# Altium schematic sheet ESP-USB.SchDoc
size C; SheetNumber: 0; SheetTotal: 0
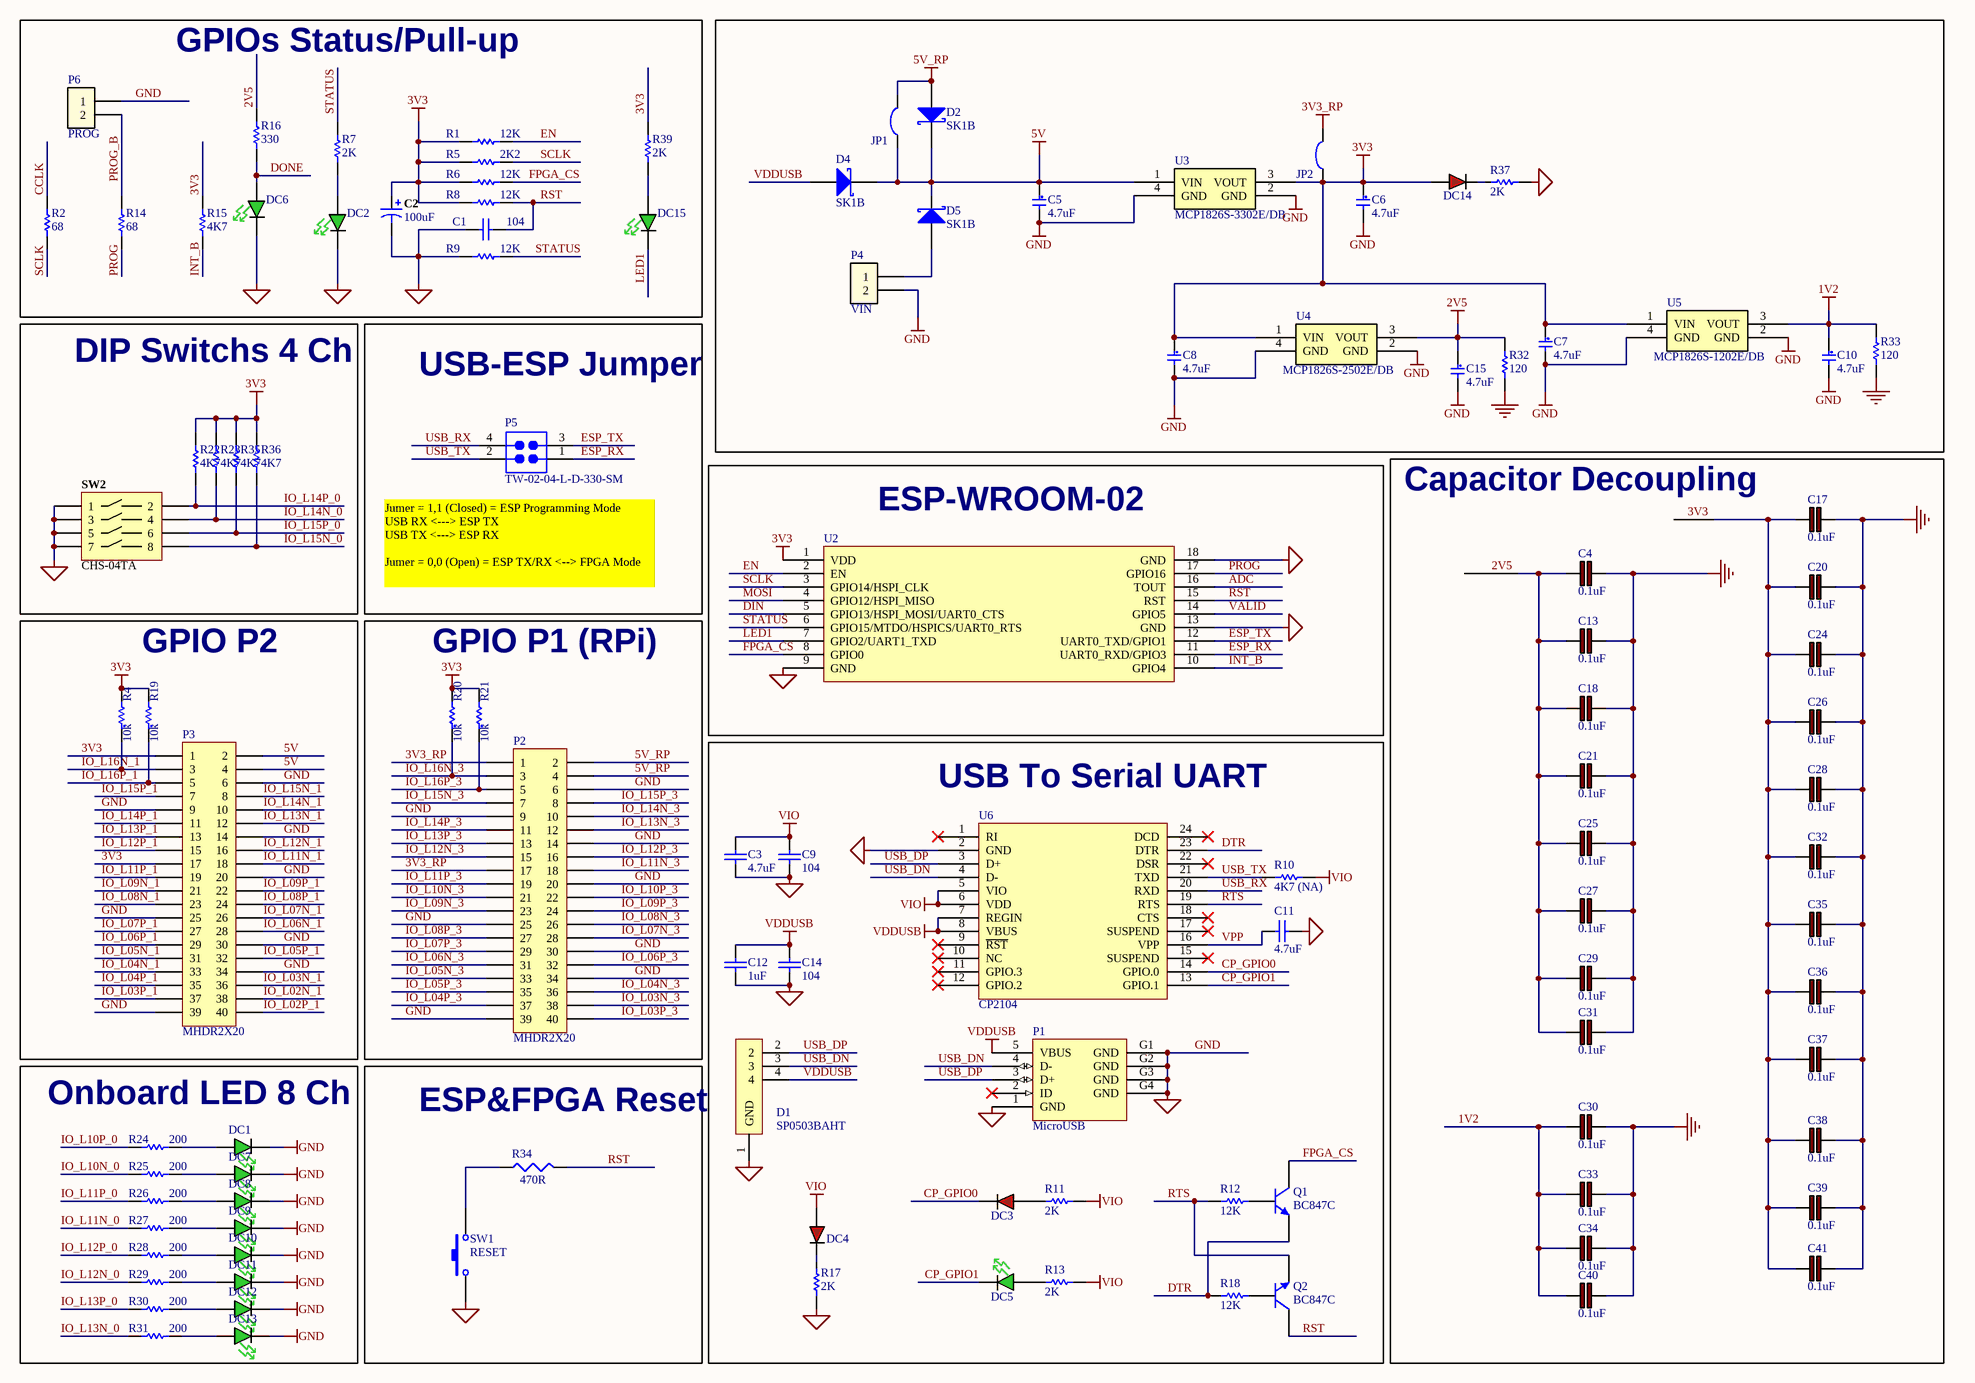
[diagram p0: ESP-USB.SchDoc]

## Parts
C1  104  [C0603 - Marked]
C2  Capacitance: 100uF  [AVX-CAPC3528_V]  (hidden comment: 100 uF Tantalum,)
C3  4.7uF  [C0603 - Marked]
C4  0.1uF  [C0603 - Marked]
C5  4.7uF  [C0603 - Marked]
C6  4.7uF  [C0603 - Marked]
C7  4.7uF  [C0603 - Marked]
C8  4.7uF  [C0603 - Marked]
C9  104  [C0603 - Marked]
C10  4.7uF  [C0603 - Marked]
C11  4.7uF  [C0603 - Marked]
C12  1uF  [C0603 - Marked]
C13  0.1uF  [C0603 - Marked]
C14  104  [C0603 - Marked]
C15  4.7uF  [C0603 - Marked]
C17  0.1uF  [C0603 - Marked]
C18  0.1uF  [C0603 - Marked]
C20  0.1uF  [C0603 - Marked]
C21  0.1uF  [C0603 - Marked]
C24  0.1uF  [C0603 - Marked]
C25  0.1uF  [C0603 - Marked]
C26  0.1uF  [C0603 - Marked]
C27  0.1uF  [C0603 - Marked]
C28  0.1uF  [C0603 - Marked]
C29  0.1uF  [C0603 - Marked]
C30  0.1uF  [C0603 - Marked]
C31  0.1uF  [C0603 - Marked]
C32  0.1uF  [C0603 - Marked]
C33  0.1uF  [C0603 - Marked]
C34  0.1uF  [C0603 - Marked]
C35  0.1uF  [C0603 - Marked]
C36  0.1uF  [C0603 - Marked]
C37  0.1uF  [C0603 - Marked]
C38  0.1uF  [C0603 - Marked]
C39  0.1uF  [C0603 - Marked]
C40  0.1uF  [C0603 - Marked]
C41  0.1uF  [C0603 - Marked]
D1  SP0503BAHT  [SOT143-4]
D2  SK1B  [EDIS_SMA]
D4  SK1B  [EDIS_SMA]
D5  SK1B  [EDIS_SMA]
DC1  (no value)  [LED_0603 - GREEN]
DC2  (no value)  [LED_0603 - GREEN]
DC3  598-8010-107F  [LED_0603 - RED]  (value not drawn)
DC4  598-8010-107F  [LED_0603 - RED]  (value not drawn)
DC5  (no value)  [LED_0603 - GREEN]
DC6  (no value)  [LED_0603 - GREEN]
DC7  (no value)  [LED_0603 - GREEN]
DC8  (no value)  [LED_0603 - GREEN]
DC9  (no value)  [LED_0603 - GREEN]
DC10  (no value)  [LED_0603 - GREEN]
DC11  (no value)  [LED_0603 - GREEN]
DC12  (no value)  [LED_0603 - GREEN]
DC13  (no value)  [LED_0603 - GREEN]
DC14  598-8010-107F  [LED_0603 - RED]  (value not drawn)
DC15  (no value)  [LED_0603 - GREEN]
JP1  Solder Jumper  [SOLDER_JUMPER]  (value not drawn)  (no BOM)
JP2  Solder Jumper  [SOLDER_JUMPER]  (value not drawn)  (no BOM)
P1  MicroUSB  [MICRO-USB-CON]
P2  MHDR2X20  [Raspberry Con]
P3  MHDR2X20  [Raspberry Con]
P4  VIN  [HEADER_2_40_100 THRU SIP]  (no BOM)
P5  TW-02-04-L-D-330-SM  [SMTC-TW-02-04-X-D-330-SM]
P6  PROG  [HEADER_2_40_100 THRU SIP]  (no BOM)
Q1  BC847C  [SOT-23]
Q2  BC847C  [SOT-23]
R1  12K  [R0603]
R2  68  [R0603]
R4  10k  [R0603]
R5  2K2  [R0603]
R6  12K  [R0603]
R7  2K  [R0603]
R8  12K  [R0603]
R9  12K  [R0603]
R10  4K7 (NA)  [R0603]
R11  2K  [R0603]
R12  12K  [R0603]
R13  2K  [R0603]
R14  68  [R0603]
R15  4K7  [R0603]
R16  330  [R0603]
R17  2K  [R0603]
R18  12K  [R0603]
R19  10k  [R0603]
R20  10k  [R0603]
R21  10k  [R0603]
R22  4K7  [R0603]
R23  4K7  [R0603]
R24  200  [R0603]
R25  200  [R0603]
R26  200  [R0603]
R27  200  [R0603]
R28  200  [R0603]
R29  200  [R0603]
R30  200  [R0603]
R31  200  [R0603]
R32  120  [R0603]
R33  120  [R0603]
R34  value 470R  [J1-0603]  (hidden comment: 470)
R35  4K7  [R0603]
R36  4K7  [R0603]
R37  2K  [R0603]
R39  2K  [R0603]
SW1  RESET  [SW_MINI]
SW2  CHS-04TA  [EHS104L]
U2  ESP8266_WROOM_02  [ESP WROOM02-Fit Size]  (value not drawn)
U3  MCP1826S-3302E/DB  [SOT223]
U4  MCP1826S-2502E/DB  [SOT223]
U5  MCP1826S-1202E/DB  [SOT223]
U6  CP2104  [QFN24 - duplicate]

## Blocks framed on the sheet
GPIOs Status/Pull-up: C1 C2 DC2 DC6 DC15 P6 R1 R2 R5-R9 R14-R16 R39
DIP Switchs 4 Ch: R22 R23 R35 R36 SW2
USB-ESP Jumper: P5
ESP-WROOM-02: U2
Capacitor Decoupling: C4 C13 C17 C18 C20 C21 C24-C41
GPIO P2: P3 R4 R19
GPIO P1 (RPi): P2 R20 R21
USB To Serial UART: C3 C9 C11 C12 C14 D1 DC3-DC5 P1 Q1 Q2 R10-R13 R17 R18 U6
Onboard LED 8 Ch: DC1 DC7-DC13 R24-R31
ESP&FPGA Reset: R34 SW1

## Nets
1V2: C10.1 C30.1 C33.1 C34.1 C40.1 R33.1 U5.3(VOUT)
2V5: C4.1 C13.1 C15.1 C18.1 C21.1 C25.1 C27.1 C29.1 C31.1 R16.1 R32.1 U4.3(VOUT)
3V3: C2.1 C6.1 C7.1 C8.1 C17.1 C20.1 C24.1 C26.1 C28.1 C32.1 C35.1 C36.1 C37.1 C38.1 C39.1 C41.1 DC14.A JP2.2 P3.1 P3.17 R1.2 R4.2 R5.2 R6.2 R8.2 R15.1 R19.2 R20.2 R21.2 R22.1 R23.1 R35.1 R36.1 R39.1 U2.1(VDD) U3.3(VOUT) U4.1(VIN) U5.1(VIN)
3V3_RP: JP2.1 P2.1 P2.17
5V: C5.1 D2.2(K) D4.2(K) D5.2(K) JP1.2 P3.2 P3.4 U3.1(VIN)
5V_RP: D2.1(A) JP1.1 P2.2 P2.4
GND: C1.1 C2.2 C3.2 C4.2 C5.2 C6.2 C7.2 C8.2 C9.2 C10.2 C11.2 C12.2 C13.2 C14.2 C15.2 C17.2 C18.2 C20.2 C21.2 C24.2 C25.2 C26.2 C27.2 C28.2 C29.2 C30.2 C31.2 C32.2 C33.2 C34.2 C35.2 C36.2 C37.2 C38.2 C39.2 C40.2 C41.2 D1.1(GND) DC1.C DC2.C DC6.C DC7.C DC8.C DC9.C DC10.C DC11.C DC12.C DC13.C P1.1(GND) P1.G1(GND) P1.G2(GND) P1.G3(GND) P1.G4(GND) P2.6 P2.9 P2.14 P2.20 P2.25 P2.30 P2.34 P2.39 P3.6 P3.9 P3.14 P3.20 P3.25 P3.30 P3.34 P3.39 P4.2 P6.1 R9.2 R17.1 R32.2 R33.2 R37.1 SW1.1 SW2.1 SW2.3 SW2.5 SW2.7 U2.9(GND) U2.13(GND) U2.18(GND) U3.2(GND) U3.4(GND) U4.2(GND) U4.4(GND) U5.2(GND) U5.4(GND) U6.2(GND)  [also labelled DGND]
VDDUSB: C12.1 C14.1 D1.4 D4.1(A) P1.5(VBUS) U6.7(REGIN) U6.8(VBUS)
VIO: C3.1 C9.1 DC4.A R10.2 R11.2 R13.2 U6.5(VIO) U6.6(VDD)
ADC: U2.16(TOUT)
CCLK: R2.1
CP_GPIO0: DC3.C U6.14(GPIO.0)
CP_GPIO1: DC5.C U6.13(GPIO.1)
DIN: U2.5(GPIO13/HSPI_MOSI/UART0_CTS)
DONE: DC6.A R16.2
DTR: Q1.2(E) R18.2 U6.23(DTR)
EN: R1.1 U2.2(EN)
ESP_RX: P5.1 U2.11(UART0_RXD/GPIO3)
ESP_TX: P5.3 U2.12(UART0_TXD/GPIO1)
FPGA_CS: Q1.3(C) R6.1 U2.8(GPIO0)
INT_B: R15.2 U2.10(GPIO4)
IO_L02N_1: P3.38
IO_L02P_1: P3.40
IO_L03N_1: P3.36
IO_L03N_3: P2.38
IO_L03P_1: P3.37
IO_L03P_3: P2.40
IO_L04N_1: P3.33
IO_L04N_3: P2.36
IO_L04P_1: P3.35
IO_L04P_3: P2.37
IO_L05N_1: P3.31
IO_L05N_3: P2.33
IO_L05P_1: P3.32
IO_L05P_3: P2.35
IO_L06N_1: P3.28
IO_L06N_3: P2.31
IO_L06P_1: P3.29
IO_L06P_3: P2.32
IO_L07N_1: P3.26
IO_L07N_3: P2.28
IO_L07P_1: P3.27
IO_L07P_3: P2.29
IO_L08N_1: P3.23
IO_L08N_3: P2.26
IO_L08P_1: P3.24
IO_L08P_3: P2.27
IO_L09N_1: P3.21
IO_L09N_3: P2.23
IO_L09P_1: P3.22
IO_L09P_3: P2.24
IO_L10N_0: R25.2
IO_L10N_3: P2.21
IO_L10P_0: R24.2
IO_L10P_3: P2.22
IO_L11N_0: R27.2
IO_L11N_1: P3.18
IO_L11N_3: P2.18
IO_L11P_0: R26.2
IO_L11P_1: P3.19
IO_L11P_3: P2.19
IO_L12N_0: R29.2
IO_L12N_1: P3.16
IO_L12N_3: P2.15
IO_L12P_0: R28.2
IO_L12P_1: P3.15
IO_L12P_3: P2.16
IO_L13N_0: R31.2
IO_L13N_1: P3.12
IO_L13N_3: P2.12
IO_L13P_0: R30.2
IO_L13P_1: P3.13
IO_L13P_3: P2.13
IO_L14N_0: R23.2 SW2.4
IO_L14N_1: P3.10
IO_L14N_3: P2.10
IO_L14P_0: R22.2 SW2.2
IO_L14P_1: P3.11
IO_L14P_3: P2.11
IO_L15N_0: R36.2 SW2.8
IO_L15N_1: P3.8
IO_L15N_3: P2.7
IO_L15P_0: R35.2 SW2.6
IO_L15P_1: P3.7
IO_L15P_3: P2.8
IO_L16N_1: P3.3 R4.1
IO_L16N_3: P2.3 R20.1
IO_L16P_1: P3.5 R19.1
IO_L16P_3: P2.5 R21.1
LED1: DC15.C U2.7(GPIO2/UART1_TXD)
MOSI: U2.4(GPIO12/HSPI_MISO)
PROG: R14.2 U2.17(GPIO16)
PROG_B: P6.2 R14.1
RST: C1.2 Q2.3(C) R8.1 R34.2 U2.15(RST)
RTS: Q2.2(E) R12.2 U6.19(RTS)
SCLK: R2.2 R5.1 U2.3(GPIO14/HSPI_CLK)
STATUS: R7.1 R9.1 U2.6(GPIO15/MTDO/HSPICS/UART0_RTS)
USB_DN: D1.3 P1.4(D-) U6.4(D-)
USB_DP: D1.2 P1.3(D+) U6.3(D+)
USB_RX: P5.4 U6.20(RXD)
USB_TX: P5.2 R10.1 U6.21(TXD)
VALID: U2.14(GPIO5)
VPP: C11.1 U6.16(VPP)
NetD5_1: D5.1(A) P4.1
NetDC1_A: DC1.A R24.1
NetDC2_A: DC2.A R7.2
NetDC3_A: DC3.A R11.1
NetDC4_C: DC4.C R17.2
NetDC5_A: DC5.A R13.1
NetDC7_A: DC7.A R25.1
NetDC8_A: DC8.A R26.1
NetDC9_A: DC9.A R27.1
NetDC10_A: DC10.A R28.1
NetDC11_A: DC11.A R29.1
NetDC12_A: DC12.A R30.1
NetDC13_A: DC13.A R31.1
NetDC14_C: DC14.C R37.2
NetDC15_A: DC15.A R39.2
NetQ1_1: Q1.1(B) R12.1
NetQ2_1: Q2.1(B) R18.1
NetR34_1: R34.1 SW1.2

Not connected (* = marked no-connect by the designer): P1 2(ID)*; U6 1(RI)* 9(~{RST})* 10(NC)* 11(GPIO.3)* 12(GPIO.2)* 15(SUSPEND)* 17(SUSPEND)* 18(CTS)* 22(DSR)* 24(DCD)*

## Notes on the sheet
- (near P5) Jumer = 1,1 (Closed) = ESP Programming Mode
  USB RX <---> ESP TX
  USB TX <---> ESP RX
  Jumer = 0,0 (Open) = ESP TX/RX <--> FPGA Mode

## Library data of the parts
C1 C9 C14 = Cap Semi: Capacitor 0603; MFG: KEMET; MFG P/N: C0603C104J5RACTU; Supplier1: ES; Supplier1 Price: 0.6
C2 = CMP-0279-00001-1: Capacitor, Tantalum, 100uF 10% 20V MCCT-B (3528); PartNumber: TAJB106K020R; Manufacturer: AVX; Polarity: Polarized; PackageDescription: 2-Pin SMT Capacitor, 3.5 x 2.8 mm Body; ComponentLink1URL: http://www.avx.com/; PackageReference: CAPC3528; ComponentLink2Description: Datasheet; Technology: Tantalum; ComponentLink2URL: http://www.avx.com/docs/Catalogs/taj.pdf; Tolerance: 10%; ComponentLink1Description: Manufacturer URL; Rated Voltage: 20V; DatasheetVersion: Jun-13; Mounting Technology: Surface Mount; Manufacturer_PN: TAJB106K020R; Manufacturer Part Number: TAJB106K020R
C3 C11 = Cap: Capacitor 0603; MFG: KEMET; MFG P/N: C0603C475K8PACTU; Supplier1: ES; Supplier1 Price: 1.86
C4 C13 C17 C18 C20 C21 C24-C41 = CAP: Capacitor
C5-C8 C10 C15 = C0603 - GRM188R60J475KE19D: 4.7uF 6.3volts X5R 10% (MLCC) - SMD/SMT 0603; Manufacturer: Murata Electronics North America; Capacitance: 4.7µF; Voltage - Rated: 6.3V; Value: 4.7uF; Supplier 1: Digi-Key; Supplier Part Number 1: 490-3297-1-ND; Manufacturer Part Number: GRM188R60J475KE19D; RoHS: RoHS Compliant; Category: Capacitors; Stock 1: 614848; Pricing 1: 1=0.19, 10=0.132, 50=0.076, 100=0.0627, 250=0.05284, 500=0.04426, 1000=0.03633 (USD); Tolerance: ±10%; Package / Case: 0603 (1608 Metric); Packaging: Cut Tape (CT); ComponentLink1URL: http://search.murata.co.jp/Ceramy/image/img/PDF/ENG/GRM188R60J475KE19.pdf; ComponentLink1Description: http://search.murata.co.jp/Ceramy/image/img/PDF/ENG/GRM188R60J475KE19.pdf; Temperature Coefficient: X5R; Mounting Type: Surface Mount, MLCC; Operating Temperature: -55°C ~ 85°C; Applications: General Purpose; Ratings: -; Size / Dimension: 0.063" L x 0.031" W (1.60mm x 0.80mm); Height - Seated (Max): -; Thickness (Max): 0.035" (0.90mm); Lead Spacing: -; Features: -; Lead Style: -
C12 = Cap Semi: Capacitor 0603; MFG: KEMET; MFG P/N: GRM188R61H105KAALD; Supplier1: ES; Supplier1 Price: 1.31
D1 = SP0503BAHT: TVS DIODE 5.5VWM 8.5VC SOT143; MFG P/N: SP0503BAHTG; MFG: GTK; Supplier1: Digikey; Supplier1 Price: 24.28
D2 D4 D5 = D Schottky: Schottky Diode; MFG: EIC; Supplier1: ES; Supplier1 Price: 3.01; MFG P/N: SK1B
DC1 DC2 DC5-DC13 DC15 = APT1608CGCK: LED 1.6X0.8MM 570NM GRN CLR SMD; Manufacturer: Kingbright Corp; Current - Test: 20mA; Wavelength - Peak: 574nm; Millicandela Rating: 50mcd; Voltage - Forward (Vf) Typ: 2.1V; Lens Type: Clear; Lens Style/Size: Rectangle with Flat Top, 1.2mm x 0.8mm; Viewing Angle: 120°; Supplier 1: Digi-Key; Supplier Part Number 1: 754-1116-1-ND; Manufacturer Part Number: APT1608CGCK; RoHS: RoHS Compliant; Category: Optoelectronics; Stock 1: 98122; Pricing 1: 1=0.2, 10=0.153, 25=0.1224, 100=0.1105, 250=0.102, 500=0.0918 (USD); Color: Green; Luminous Flux @ Current - Test: -; Wavelength - Dominant: 570nm; Size / Dimension: 1.60mm L x 0.80mm W; Height: 0.75mm; Package / Case: 0603 (1608 Metric); Mounting Type: Surface Mount; Packaging: Cut Tape (CT); ComponentLink1URL: http://www.us.kingbright.com/images/catalog/SPEC/APT1608CGCK.pdf; ComponentLink1Description: http://www.us.kingbright.com/images/catalog/SPEC/APT1608CGCK.pdf
DC3 DC4 DC14 = LED0603 - 598-8010-107F: LED ALINGAP RED CLEAR 0603 SMD; Manufacturer: Dialight; Current - Test: 20mA; Wavelength - Dominant: 635nm; Millicandela Rating: 40mcd; Voltage - Forward (Vf) Typ: 2.2V; Lens Style/Size: Rectangle with Flat Top, 1.1mm x 0.8mm; Viewing Angle: 140°; Accept Replacement: YES - Water Clear; Supplier 1: Digi-Key; Manufacturer Part Number: 598-8010-107F; RoHS: RoHS Compliant; Category: Optoelectronics; Stock 1: 37578; Pricing 1: 1=0.45, 10=0.33, 25=0.264, 100=0.1749, 250=0.1452, 500=0.1056, 1000=0.0825 (USD); Color: Red; Luminous Flux @ Current - Test: -; Wavelength - Peak: -; Lens Type: Clear; Size / Dimension: 1.60mm L x 0.80mm W; Height: 0.70mm; Package / Case: 0603 (1608 Metric); Mounting Type: Surface Mount; Packaging: Digi-Reel®; ComponentLink1URL: http://media.digikey.com/pdf/Data%20Sheets/Dialight%20PDFs/598_Series_0603_Pkg.pdf; ComponentLink1Description: http://media.digikey.com/pdf/Data%20Sheets/Dialight%20PDFs/598_Series_0603_Pkg.pdf; Supplier Part Number 1: 350-2029-6-ND
JP1 JP2 = Solder Jumper: Solder/Configuration Jumper; Manufacturer: n/a; Manufacturer Part Number: n/a; Source: n/a; Source Part Number: n/a; ROHS Certificate: n/a
P1 = ESOC004: Micro USB 5Pins,Female B type Right Angle, SMT; MFG P/N: MRUMRB05FTKTY-30U; MFG: GTK; Supplier1: ES; Supplier1 Price: 15.35
P2 P3 = MHDR2X20: Header, 20-Pin, Dual row; LatestRevisionDate: 17-Jul-2002; LatestRevisionNote: Re-released for DXP Platform.; Publisher: Altium Limited
P4 P6 = Header2: Header 2 pin
P5 = CMP-1029-00319-1: SMT Board Stacker, Vertical, -55 to 125 degC, 2 mm Pitch, 4-Pin, Male, RoHS; Manufacturer: Samtec; Pitch: 2 mm; PackageDescription: High Temp 2mm SMT Board Stacking Terminal Strip ASM; ComponentLink1Description: Manufacturer URL; PackageVersion: CL, 3/1993; ComponentLink3URL: http://www.samtec.com/documents/webfiles/cpdf/TW-XX-XX-XXX-X-XXX-SM-XXX-XX-MKT1.pdf; Temperature Range: -55 to 125 degC; Orientation: Vertical; ComponentLink2Description: Datasheet; RoHS: True; ComponentLink1URL: http://www.samtec.com; ComponentLink3Description: Package Specification; DatasheetVersion: F-214; PartNumber: TW-02-04-L-D-330-SM; PackageReference: TW-02-04-X-D-330-SM; ComponentLink2URL: http://d2a072wq521u33.cloudfront.net/catalog_english//TW_SM.PDF; Mounting Technology: Surface Mount
Q1 Q2 = NPN: NPN Bipolar Transistor; MFG: PHILIPS/NXP; MFG P/N: BC847C,215; Supplier1: ES; Supplier1 Price: 0.53
R1 R2 R6-R9 R12 R14-R16 R18 R22 R23 R32 R33 R35 R36 R39 = Res Semi: Resistor 0603; MFG: ROHM; MFG P/N: MCR03ERTF1202; Supplier1: Digikey; Supplier1 Price: 0.4
R4 R19-R21 = R0603 - CRCW060310K0FKEA: 10k Thick Film Resistors - SMD 1/10watt 10Kohms 1%; Manufacturer: Vishay Dale; Power (Watts): 0.1W, 1/10W; Temperature Coefficient: ±100ppm/°C; Manufacturer Part Number: CRCW060310K0FKEA; Value: 10k; Supplier 1: Digi-Key; RoHS: RoHS Compliant; Category: Resistors; Stock 1: 997856; Pricing 1: 10=0.081, 50=0.0436, 200=0.0251, 1000=0.01711 (USD); Resistance (Ohms): 10K; Composition: Thick Film; Features: -; Tolerance: ±1%; Size / Dimension: 0.061" L x 0.033" W (1.55mm x 0.85mm); Height: 0.020" (0.50mm); Packaging: Cut Tape (CT); Package / Case: 0603 (1608 Metric); ComponentLink1URL: http://www.vishay.com/doc?20035; ComponentLink1Description: http://www.vishay.com/doc?20035; Supplier Part Number 1: 541-10.0KHCT-ND; Number of Terminations: 2
R5 = Res Semi: Resistor 0603; MFG: ROHM; MFG P/N: MCR03ERTF2201; Supplier1: Digikey; Supplier1 Price: 0.4
R10 = Res Semi: Resistor 0603; MFG P/N: NA
R11 R13 R17 R37 = Res Semi: Resistor 0603; MFG: ROHM; MFG P/N: MCR03ERTF2001; Supplier1: Digikey; Supplier1 Price: 0.4
R24-R31 = ERJ-3EKF2000V: RES 200 OHM 1/10W 1% 0603 SMD; Manufacturer: Panasonic - ECG; Power (Watts): 0.1W, 1/10W; Temperature Coefficient: ±100ppm/°C; Manufacturer Part Number: ERJ-3EKF2000V; Value: RES 200 OHM 1/10W 1% 0603 SMD; Supplier 1: Digi-Key; Supplier Part Number 1: P200HCT-ND; RoHS: RoHS Compliant; Category: Resistors; Stock 1: 1279595; Pricing 1: 1=0.04, 50=0.015, 100=0.0114, 250=0.00844, 500=0.00624, 1000=0.00416 (USD); Resistance (Ohms): 200; Composition: Thick Film; Features: -; Tolerance: ±1%; Size / Dimension: 0.063" L x 0.031" W (1.60mm x 0.80mm); Height: 0.018" (0.45mm); Lead Style: Surface Mount (SMD - SMT); Packaging: Cut Tape (CT); Package / Case: 0603 (1608 Metric); ComponentLink1URL: http://industrial.panasonic.com/www-cgi/jvcr13pz.cgi?E+PZ+3+AOA0002+ERJ3EKF2000V+7+WW; ComponentLink1Description: http://industrial.panasonic.com/www-cgi/jvcr13pz.cgi?E+PZ+3+AOA0002+ERJ3EKF2000V+7+WW
R34 = Res3: Resistor; Published: 8-Jun-2000; LatestRevisionDate: 29-May-2009; LatestRevisionNote: IPC-7351 Footprint Added.; PackageReference: J1-0603; Publisher: Altium Limited; PackageDescription: Chip Resistor
SW1 = SW-PB: Tact Switch; MFG: ALPS; MFG P/N: SKRKAHE010; Supplier1: Mouser; Supplier1 Price: 19.06
SW2 = CHS-04TA: SWITCH DIP 4-POS SLIDE SMD 6V; Manufacturer: Copal Electronics Inc; Circuit: SPST; Number of Positions: 4; Contact Rating @ Voltage: 0.1A @ 6VDC; Actuator Type: Standard; Actuator Level: Flush; Washable: Yes; Supplier 1: Digi-Key; Manufacturer Part Number: CHS-04TA; RoHS: RoHS Compliant; Category: Switches; Stock 1: 2000; Pricing 1: 500=1.33876, 1000=1.1475, 5000=1.05188 (USD); Mounting Type: Surface Mount; Orientation: Top Actuated; ComponentLink1URL: http://copal-electronics.info/en/0008e/0267f.pdf; ComponentLink1Description: http://copal-electronics.info/en/0008e/0267f.pdf; Supplier Part Number 1: 563-1007-2-ND; Manufacturer_PN: CHS-04TA
U2 = ESP8266 WROOM 02: WiFi Serial Transceiver Module (ESP8266); MFG P/N: ESP-WROOM-02; MFG: ESPRESSIF; Supplier1 Price: 95.34; Supplier1: stock
U3 = REG - MCP1826S-3302E/DB: LDO REG 1A 3.3V SOT223-3; Manufacturer: Microchip Technology; Regulator Topology: Positive Fixed; Voltage - Input: Up to 6V; Voltage - Dropout (Typical): 0.25V @ 1A; Number of Regulators: 1; Current - Output: 1A (Min); Value: MCP1826S-3302E/DB; Supplier 1: Digi-Key; Supplier Part Number 1: MCP1826S-3302E/DB-ND; Manufacturer Part Number: MCP1826S-3302E/DB; RoHS: RoHS Compliant; Category: Integrated Circuits (ICs); Stock 1: 2041; Pricing 1: 1=0.74, 10=0.68, 25=0.57, 100=0.52 (USD); Voltage - Output: 3.3V; Current - Limit (Min): -; Operating Temperature: -40°C ~ 125°C; Mounting Type: Surface Mount; Package / Case: TO-261-4, TO-261AA; Supplier Device Package: SOT-223-3; Packaging: Tube; ComponentLink1URL: http://ww1.microchip.com/downloads/en/DeviceDoc/22057a.pdf; ComponentLink1Description: http://ww1.microchip.com/downloads/en/DeviceDoc/22057a.pdf
U4 = MCP1826S-1202E/DB: IC LDO REG 1A 2.5V SOT223-3; Manufacturer: Microchip Technology; Regulator Topology: Positive Fixed; Voltage - Input: Up to 6V; Voltage - Dropout (Typical): 0.25V @ 1A; Number of Regulators: 1; Current - Output: 1A (Min); Value: MCP1826S-2502E/DB; Supplier 1: Digi-Key; Supplier Part Number 1: MCP1826S-2502E/DB-ND; Manufacturer Part Number: MCP1826S-1202E/DB; RoHS: RoHS Compliant; Category: Integrated Circuits (ICs); Stock 1: 2041; Pricing 1: 1=0.74, 10=0.68, 25=0.57, 100=0.52 (USD); Voltage - Output: 2.5V; Current - Limit (Min): -; Operating Temperature: -40°C ~ 125°C; Mounting Type: Surface Mount; Package / Case: TO-261-4, TO-261AA; Supplier Device Package: SOT-223-3; Packaging: Tube; ComponentLink1URL: http://ww1.microchip.com/downloads/en/DeviceDoc/22057a.pdf; ComponentLink1Description: http://ww1.microchip.com/downloads/en/DeviceDoc/22057a.pdf
U5 = MCP1826S-1202E/DB: IC LDO REG 1A 1.2V SOT223-3; Manufacturer: Microchip Technology; Regulator Topology: Positive Fixed; Voltage - Input: Up to 6V; Voltage - Dropout (Typical): 0.25V @ 1A; Number of Regulators: 1; Current - Output: 1A (Min); Value: MCP1826S-1202E/DB; Supplier 1: Digi-Key; Supplier Part Number 1: MCP1826S-1202E/DB-ND; Manufacturer Part Number: MCP1826S-1202E/DB; RoHS: RoHS Compliant; Category: Integrated Circuits (ICs); Stock 1: 2041; Pricing 1: 1=0.74, 10=0.68, 25=0.57, 100=0.52 (USD); Voltage - Output: 1.2V; Current - Limit (Min): -; Operating Temperature: -40°C ~ 125°C; Mounting Type: Surface Mount; Package / Case: TO-261-4, TO-261AA; Supplier Device Package: SOT-223-3; Packaging: Tube; ComponentLink1URL: http://ww1.microchip.com/downloads/en/DeviceDoc/22057a.pdf; ComponentLink1Description: http://ww1.microchip.com/downloads/en/DeviceDoc/22057a.pdf
U6 = CP2104: IC SGL USB-TO-UART BRIDGE 24QFN; MFG P/N: CP2104-F03-GM; MFG: Silicon Labs; Supplier1: Digikey; Supplier1 Price: 61.5